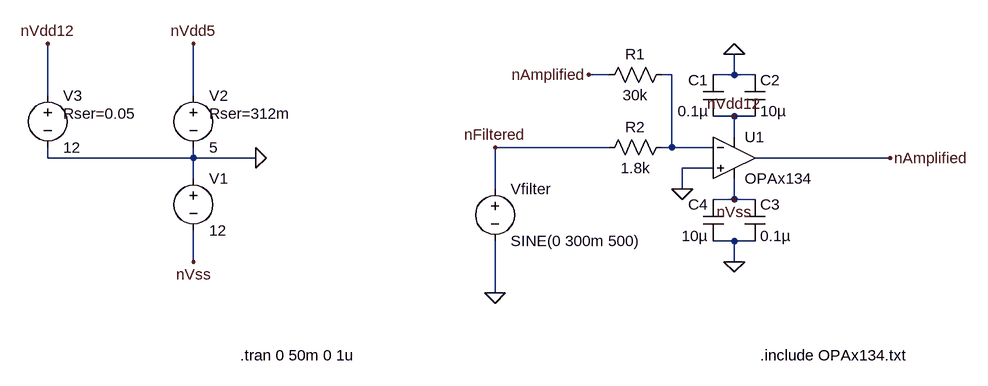
[diagram p0: schematic Stage3Amplify.asc]
Stage3Amplify.asc, the LTspice schematic file:
Version 4
SHEET 1 1296 680
WIRE 720 -64 688 -64
WIRE 816 -64 800 -64
WIRE 912 -64 912 -96
WIRE 912 -64 880 -64
WIRE 944 -64 912 -64
WIRE -144 -32 -144 -112
WIRE 80 -32 80 -112
WIRE 912 0 880 0
WIRE 944 0 912 0
WIRE 912 32 912 0
WIRE 720 48 544 48
WIRE 816 48 816 -64
WIRE 816 48 800 48
WIRE 880 48 816 48
WIRE -144 64 -144 48
WIRE 80 64 80 48
WIRE 80 64 -144 64
WIRE 176 64 80 64
WIRE 1152 64 944 64
WIRE 880 80 832 80
WIRE 80 96 80 64
WIRE 544 112 544 48
WIRE 832 112 832 80
WIRE 912 128 912 96
WIRE 912 128 880 128
WIRE 944 128 912 128
WIRE 912 192 880 192
WIRE 944 192 912 192
WIRE 80 224 80 176
WIRE 912 224 912 192
WIRE 544 272 544 192
FLAG 176 64 0
FLAG 80 224 nVss
FLAG 80 -112 nVdd5
FLAG -144 -112 nVdd12
FLAG 912 0 nVdd12
FLAG 912 128 nVss
FLAG 832 112 0
FLAG 1152 64 nAmplified
FLAG 544 48 nFiltered
FLAG 688 -64 nAmplified
FLAG 912 -96 0
FLAG 912 224 0
FLAG 544 272 0
SYMBOL voltage 80 80 R0
WINDOW 123 0 0 Left 0
WINDOW 39 0 0 Left 0
SYMATTR InstName V1
SYMATTR Value 12
SYMBOL voltage 80 -48 R0
WINDOW 123 0 0 Left 0
WINDOW 39 24 44 Left 2
SYMATTR InstName V2
SYMATTR Value 5
SYMATTR SpiceLine Rser=312m
SYMBOL voltage -144 -48 R0
WINDOW 123 0 0 Left 0
WINDOW 39 24 44 Left 2
SYMATTR InstName V3
SYMATTR Value 12
SYMATTR SpiceLine Rser=0.05
SYMBOL res 816 -80 R90
WINDOW 0 0 56 VBottom 2
WINDOW 3 32 56 VTop 2
SYMATTR InstName R1
SYMATTR Value 30k
SYMATTR SpiceLine tol=1 pwr=0.25
SYMBOL res 816 32 R90
WINDOW 0 0 56 VBottom 2
WINDOW 3 32 56 VTop 2
SYMATTR InstName R2
SYMATTR Value 1.8k
SYMATTR SpiceLine tol=1 pwr=0.25
SYMBOL OpAmps\\opamp2 912 0 R0
SYMATTR InstName U1
SYMATTR Value OPAx134
SYMBOL cap 896 0 R180
WINDOW 0 24 56 Left 2
WINDOW 3 24 8 Left 2
SYMATTR InstName C1
SYMATTR Value 0.1µ
SYMATTR SpiceLine V=16 Irms=0.6 Rser=0.05
SYMBOL cap 928 -64 R0
SYMATTR InstName C2
SYMATTR Value 10µ
SYMATTR SpiceLine V=10 Irms=1.25 Rser=5m
SYMBOL cap 928 128 R0
SYMATTR InstName C3
SYMATTR Value 0.1µ
SYMATTR SpiceLine V=16 Irms=0.6 Rser=0.05
SYMBOL cap 896 192 R180
WINDOW 0 24 56 Left 2
WINDOW 3 24 8 Left 2
SYMATTR InstName C4
SYMATTR Value 10µ
SYMATTR SpiceLine V=10 Irms=1.25 Rser=5m
SYMBOL voltage 544 96 R0
WINDOW 123 0 0 Left 0
WINDOW 39 0 0 Left 0
SYMATTR InstName Vfilter
SYMATTR Value SINE(0 300m 500)
TEXT 152 368 Left 2 !.tran 0 50m 0 1u
TEXT 952 368 Left 2 !.include OPAx134.txt

The netlist it stands for:
* Stage3Amplify.asc
V1 0 nVss 12
V2 nVdd5 0 5 Rser=312m
V3 nVdd12 0 12 Rser=0.05
R1 N001 nAmplified 30k tol=1 pwr=0.25
R2 N001 nFiltered 1.8k tol=1 pwr=0.25
XU1 0 N001 nVdd12 nVss nAmplified OPAx134  ; pins In+ In- V+ V- OUT
C1 nVdd12 0 0.1µ V=16 Irms=0.6 Rser=0.05
C2 0 nVdd12 10µ V=10 Irms=1.25 Rser=5m
C3 nVss 0 0.1µ V=16 Irms=0.6 Rser=0.05
C4 0 nVss 10µ V=10 Irms=1.25 Rser=5m
Vfilter nFiltered 0 SINE(0 300m 500)
.tran 0 50m 0 1u
.include OPAx134.txt
.backanno
.end